# EAGLE design Atmega16 (EAGLE 6.2)
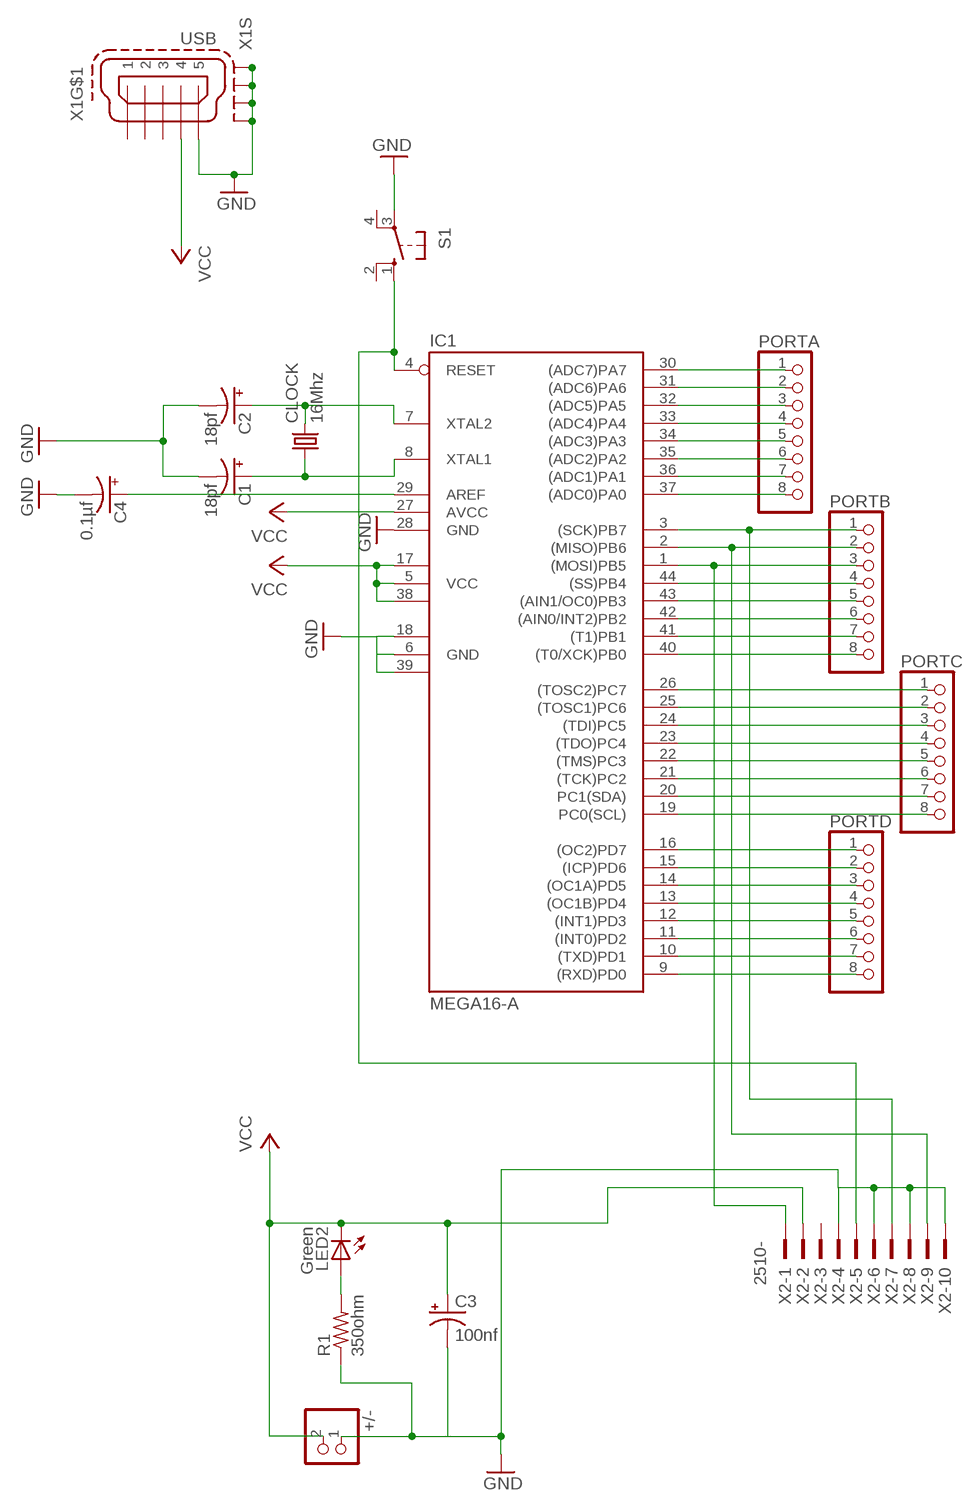
[diagram p0: schematic, sheet 1]

## Parts
+/-  PINHD-1X2  [1X02]
C1  18pf  CPOL-USSMCZ  [SMC_Z]
C2  18pf  CPOL-USSMCZ  [SMC_Z]
C3  100nf  CPOL-USSMCZ  [SMC_Z]
C4  0.1µf  CPOL-USSMCZ  [SMC_Z]
CLOCK  16Mhz  CRYSTALHC49UP  [HC49UP]
IC1  MEGA16-A  [TQFP44]
LED2  Green  LG_T679-E1F1-1  [PLCC2]
PORTA  PINHD-1X8  [1X08]
PORTB  PINHD-1X8  [1X08]
PORTC  PINHD-1X8  [1X08]
PORTD  PINHD-1X8  [1X08]
R1  350ohm  R-US_M0805  [M0805]
S1  10-XX  [B3F-10XX]
X1  USB  MINI-USB-SCHIELD-32005-201  [32005-201]
X2  2510-  [PAK100/2500-10]

## Nets
GND: +/-.1 C1.- C2.- C3.- C4.- IC1.6(GND) IC1.18(GND1) IC1.28(GND) IC1.39(GND2) R1.1 S1.3(P) X1.5 X1.M1(S:S1) X1.M2(S:S2) X1.M3(S:S3) X1.M4(S:S4) X2.4 X2.6 X2.8 X2.10
N$1: C2.+ CLOCK.2 IC1.7(XTAL2)
N$2: IC1.16((OC2)PD7) PORTD.1
N$3: S1.1(S) X2.5
N$4: LED2.A R1.2
N$5: IC1.15((ICP)PD6) PORTD.2
N$6: IC1.14((OC1A)PD5) PORTD.3
N$7: C1.+ CLOCK.1 IC1.8(XTAL1)
N$8: C4.+ IC1.29(AREF)
N$10: IC1.13((OC1B)PD4) PORTD.4
N$12: IC1.12((INT1)PD3) PORTD.5
N$13: IC1.11((INT0)PD2) PORTD.6
N$14: IC1.10((TXD)PD1) PORTD.7
N$15: IC1.9((RXD)PD0) PORTD.8
N$16: IC1.26((TOSC2)PC7) PORTC.1
N$17: IC1.25((TOSC1)PC6) PORTC.2
N$18: IC1.24((TDI)PC5) PORTC.3
N$19: IC1.23((TDO)PC4) PORTC.4
N$20: IC1.22((TMS)PC3) PORTC.5
N$21: IC1.21((TCK)PC2) PORTC.6
N$22: IC1.20(PC1(SDA)) PORTC.7
N$23: IC1.19(PC0(SCL)) PORTC.8
N$24: IC1.3((SCK)PB7) PORTB.1 X2.7
N$25: IC1.2((MISO)PB6) PORTB.2 X2.9
N$26: IC1.1((MOSI)PB5) PORTB.3 X2.1
N$27: IC1.44((SS)PB4) PORTB.4
N$28: IC1.43((AIN1/OC0)PB3) PORTB.5
N$29: IC1.42((AIN0/INT2)PB2) PORTB.6
N$30: IC1.41((T1)PB1) PORTB.7
N$31: IC1.40((T0/XCK)PB0) PORTB.8
N$32: IC1.30((ADC7)PA7) PORTA.1
N$33: IC1.31((ADC6)PA6) PORTA.2
N$34: IC1.32((ADC5)PA5) PORTA.3
N$35: IC1.33((ADC4)PA4) PORTA.4
N$36: IC1.34((ADC3)PA3) PORTA.5
N$37: IC1.35((ADC2)PA2) PORTA.6
N$38: IC1.36((ADC1)PA1) PORTA.7
N$39: IC1.37((ADC0)PA0) PORTA.8
VCC: +/-.2 C3.+ IC1.5(VCC) IC1.17(VCC1) IC1.27(AVCC) IC1.38(VCC2) LED2.C X1.4 X2.2
Unconnected: IC1.4(RESET) S1.2(S1) S1.4(P1) X1.1 X1.2 X1.3 X2.3

## Library data of the parts
+/- = pinhead:PINHD-1X2: PIN HEADER
C1-C4 = rcl:CPOL-US: POLARIZED CAPACITOR, American symbol
CLOCK = crystal:CRYSTAL: CRYSTAL; OC_FARNELL: unknown; OC_NEWARK: unknown
IC1 = atmel:MEGA16: MICROCONTROLLER 16 Kbytes FLASH 1 kbytes SRAM 512 bytes EEPROM USART 8-channel 10 bit ADC Source: avr.lbr; MPN: ATMEGA16-16AU; OC_FARNELL: 9171134; OC_NEWARK: 96K6515
LED2 = led:*_T679-?-1: LC TOPLED® Low Current LED Source: http://catalog.osram-os.com .. LG_LS_LY_T679_OBS.pdf; COLOR: green
PORTA PORTB PORTC PORTD = pinhead:PINHD-1X8: PIN HEADER
R1 = rcl:R-US_: RESISTOR, American symbol
S1 = switch-omron:10-XX: OMRON SWITCH; MPN: B3F-1000; OC_FARNELL: 176432; OC_NEWARK: 36M3542
X1 = con-cypressindustries:MINI-USB-SCHIELD-: MINI USB-B Conector Source: www.cypressindustries.com; OC_FARNELL: unknown; OC_NEWARK: unknown
X2 = con-3m:2510-: 3M (TM) Pak 100 4-Wall Header Source: 3M; MF: 3M; MPN: 2510-6002UB; OC_FARNELL: 9838244; OC_NEWARK: 46F4725

## Board
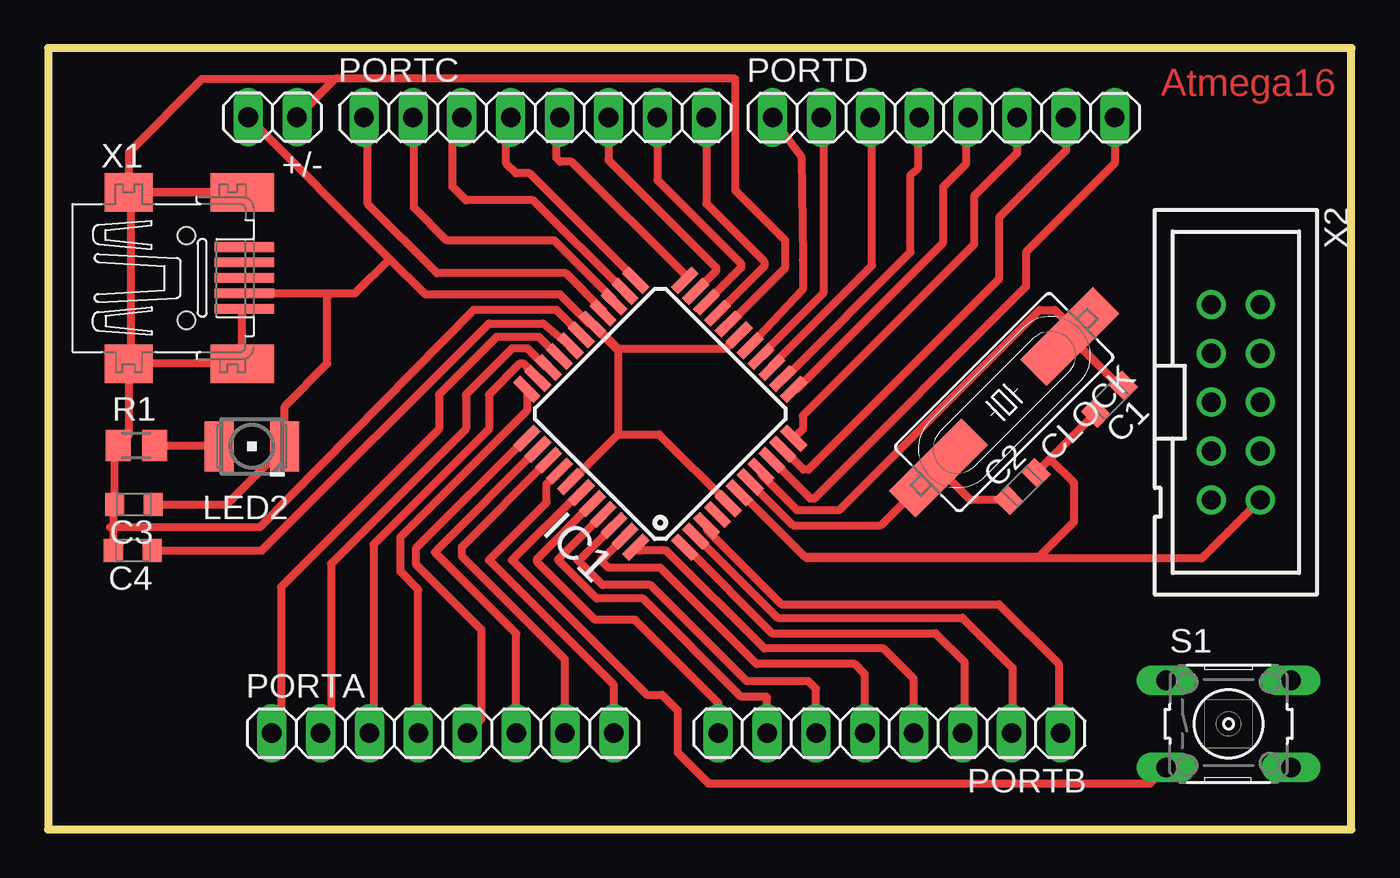
[diagram p1: board, top side]
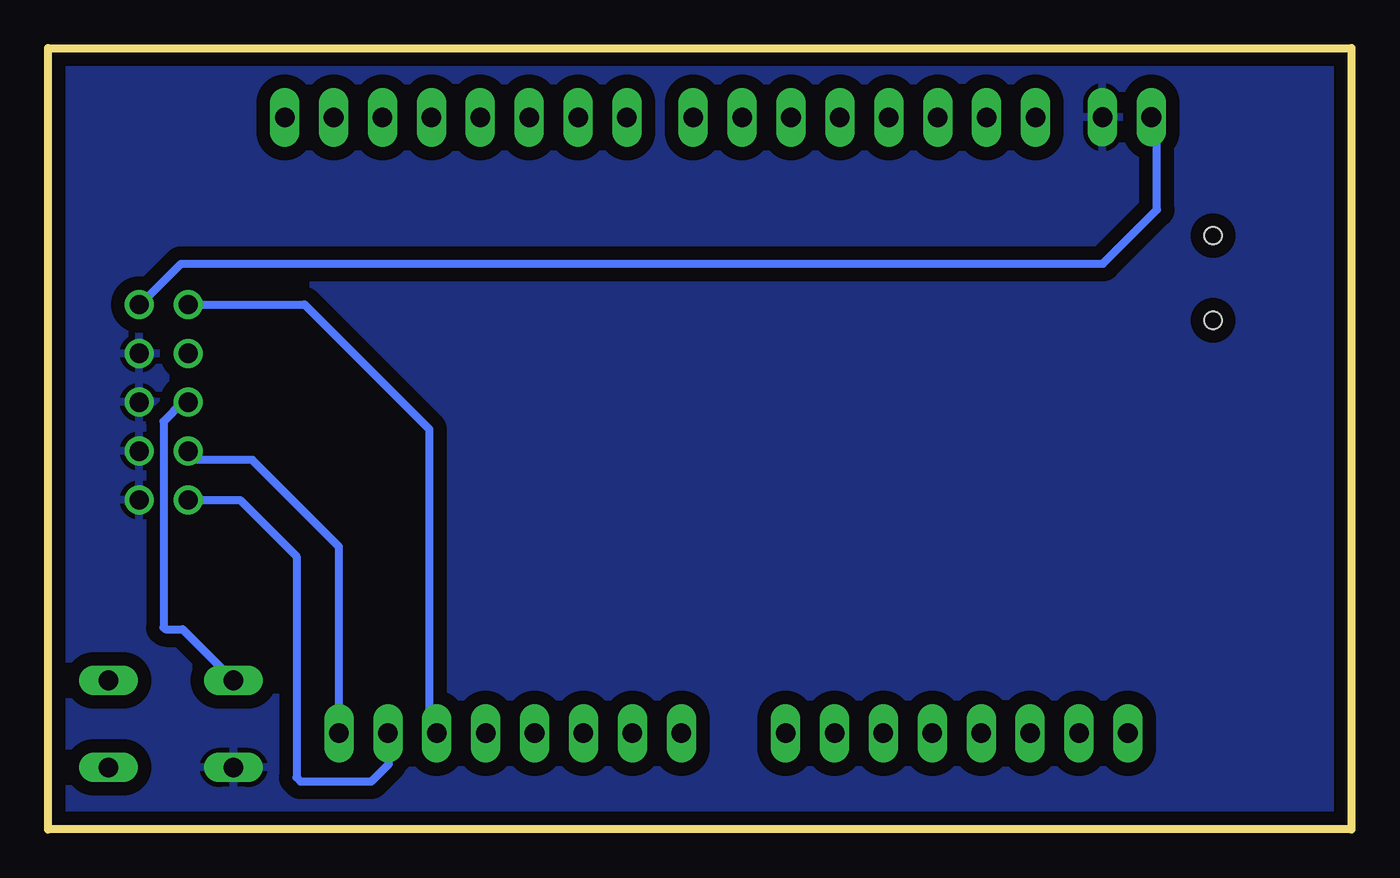
[diagram p2: board, bottom side, seen from below]

Size 67.7 x 40.6 mm. Coordinates in mm from the lower left corner, seen from the top.
Outline: 0,40.6 0,0 67.7,0 67.7,40.6 0,40.6
Copper layers (1*16): Top 0.035mm / dielectric 1.5mm / Bottom 0.035mm
Design rules: minimum track width 10mil, minimum drill 24mil, track to track 4mil, track to pad 4mil, pad to pad 8mil, via to via 8mil, smd to smd 8mil, copper to edge 10mil, drill to drill 8mil, minimum pad ring 10mil, minimum via ring 8mil, stop-mask expansion 4mil, vias tented up to drill 0mil, thermal gap 10mil

### Footprints (pad centres in the part's own frame; a part is rotated, then mirrored left to right if it is on the bottom)
1X02 = drill 1.016 long: 1 -1.27,0; 2 1.27,0
SMC_Z = smd 1 x 1.2: + -1,0; - 1,0
HC49UP = smd 5.334 x 1.93: 1 -4.826,0; 2 4.826,0
TQFP44 = smd 1.5 x 0.5: 1 -5.8,4; 2 -5.8,3.2; 3 -5.8,2.4; 4 -5.8,1.6; 5 -5.8,0.8; 6 -5.8,0; 7 -5.8,-0.8; 8 -5.8,-1.6; 9 -5.8,-2.4; 10 -5.8,-3.2; 11 -5.8,-4; 23 5.8,-4; 24 5.8,-3.2; 25 5.8,-2.4; 26 5.8,-1.6; 27 5.8,-0.8; 28 5.8,0; 29 5.8,0.8; 30 5.8,1.6; 31 5.8,2.4; 32 5.8,3.2; 33 5.8,4 | smd 0.5 x 1.5: 12 -4,-5.8; 13 -3.2,-5.8; 14 -2.4,-5.8; 15 -1.6,-5.8; 16 -0.8,-5.8; 17 0,-5.8; 18 0.8,-5.8; 19 1.6,-5.8; 20 2.4,-5.8; 21 3.2,-5.8; 22 4,-5.8; 34 4,5.8; 35 3.2,5.8; 36 2.4,5.8; 37 1.6,5.8; 38 0.8,5.8; 39 0,5.8; 40 -0.8,5.8; 41 -1.6,5.8; 42 -2.4,5.8; 43 -3.2,5.8; 44 -4,5.8
PLCC2 = smd 2.6 x 1.5: A 0,1.7; C 0,-1.7
1X08 = drill 1.016 long: 1 -8.89,0; 2 -6.35,0; 3 -3.81,0; 4 -1.27,0; 5 1.27,0; 6 3.81,0; 7 6.35,0; 8 8.89,0
M0805 = smd 1.3 x 1.6: 1 -0.95,0; 2 0.95,0
B3F-10XX = drill 1.016 long: 1 -3.251,2.261; 2 3.251,2.261; 3 -3.251,-2.261; 4 3.251,-2.261
32005-201 = smd 3.1 x 0.5: 1 3,1.6; 2 3,0.8; 3 3,0; 4 3,-0.8; 5 3,-1.6 | smd 2.5 x 2: M1 -3,-4.45; M2 -3,4.45 | smd 3.3 x 2: M3 2.9,4.45; M4 2.9,-4.45 | hole 0.9: 0,2.2; 0,-2.2
PAK100/2500-10 = drill 1 pad 1.422: 1 -5.08,-1.27; 2 -5.08,1.27; 3 -2.54,-1.27; 4 -2.54,1.27; 5 0,-1.27; 6 0,1.27; 7 2.54,-1.27; 8 2.54,1.27; 9 5.08,-1.27; 10 5.08,1.27

### Placement (x,y rotation side)
+/-  11.66,37.01 180 top
C1  55.13,22.35 225 top
C2  50.6,17.82 45 top
C3  4.46,16.89 180 top
C4  4.4,14.5 180 top
CLOCK  49.66,22.2 225 top
IC1  31.8,21.6 135 top
LED2  10.59,19.91 90 top
PORTA  20.5,5 0 top
PORTB  43.7,5 180 top
PORTC  25.3,37 0 top
PORTD  46.52,36.99 0 top
R1  4.58,19.95 0 top
S1  61.32,5.49 0 top
X1  7.19,28.66 0 top
X2  61.7,22.2 270 top

### Tracks (layer width: path | path; a pad name or v marks a point on that pad's centre or on a via)
GND
  Top 0.406: IC1.18 35.37,26.27 38.3,29.2 38.3,30.6 35.7,33.2 35.7,39 14.92,39 | 14.92,39 +/-.1 | 14.92,39 8,39 4.2,35.2 4.2,33.3 4.3,33.2 | C4.- 3.4,15.8 | 3.4,15.8 3.4,16.83 C3.- 3.46,19.78 R1.1 4.19,20.51 X1.M1 | X1.M1 X1.M4 10.09,26.96 X1.5 | X1.M2 X1.M3 4.39,33.11 4.3,33.2 | 4.3,33.2 4.3,24.32 X1.M1 | IC1.28 26.4,27 22.1,27 11,15.7 3.2,15.7 3.4,15.8 | IC1.39 27.6,17.5 24.1,14 31.1,7 31.9,7 32.7,6.2 32.7,4 34.3,2.4 57.24,2.4 S1.3 | C2.- 52.04,19.26 | 52.04,19.26 C1.- | 39.3,14.2 36,17.5 IC1.6 | 39.3,14.2 51.5,14.2 53.3,16 53.3,18 52.04,19.26 | 39.3,14.2 39.4,14.1 59.95,14.1 X2.10
  pour Bottom (isolate 0.7): 1.1,40.2 67.1,40.2 67.1,0.2 0.1,0.2 0.1,40.2
N$1
  Top 0.406: C2.+ 47.92,17.11 CLOCK.2 43.26,15.8 38.7,15.8 36.47,18.03 IC1.7
N$2
  Top 0.406: PORTD.1 39.13,34.97 39.2,29.6 39.2,28.07 IC1.16
N$3
  Bottom 0.406: X2.5 60.7,22.2 61.7,21.2 61.7,10.5 61.6,10.4 60.72,10.4 S1.1
N$4
  Top 0.406: R1.2 8.85,19.95 LED2.A
N$5
  Top 0.406: IC1.15 37.03,24.63 40.3,27.9 40.3,36.86 PORTD.2
N$6
  Top 0.406: IC1.14 37.6,24.1 42.8,29.3 42.8,36.9 PORTD.3
N$7
  Top 0.406: C1.+ 55.63,23.06 CLOCK.1 53.26,25.8 53.5,25.8 52.3,27 51.5,27 41.1,16.6 38.9,16.6 37.03,18.47 IC1.8
N$8
  Top 0.406: IC1.29 27.06,25.14 25.7,26.3 22.9,26.3 11.1,14.5 C4.+
N$10
  Top 0.406: IC1.13 38.24,23.44 44.8,30 44.8,34 45.2,34.4 45.2,36.94 PORTD.4
N$12
  Top 0.406: IC1.12 38.87,22.87 46.5,30.5 46.5,33.4 47.7,34.6 47.7,36.9 PORTD.5
N$13
  Top 0.406: PORTD.6 50.33,35.13 48.1,32.9 48.1,30.4 39.2,21.5 39.2,20.8 IC1.11
N$14
  Top 0.406: PORTD.7 52.87,35.27 49.4,31.8 49.4,28.6 39.5,18.7 39.23,18.7 IC1.10
N$15
  Top 0.406: PORTD.8 55.41,34.61 50.8,30 50.8,28.2 39.8,17.2 39.59,17.2 IC1.9
N$16
  Top 0.406: IC1.26 28.83,26.97 26.9,28.9 20.2,28.9 16.6,32.5 16.6,36.81 PORTC.1
N$17
  Top 0.406: IC1.25 29.4,27.5 26.3,30.6 20.7,30.6 19,32.3 19,36.95 PORTC.2
N$18
  Top 0.406: IC1.24 29.94,27.96 25.2,32.7 21.7,32.7 21,33.4 21,36.51 PORTC.3
N$19
  Top 0.406: IC1.23 30.53,28.57 25,34.1 24.3,34.1 23.8,34.6 23.8,36.77 PORTC.4
N$20
  Top 0.406: IC1.22 33.07,28.83 27.2,34.7 26.6,34.7 26.4,34.9 26.4,36.83 PORTC.5
N$21
  Top 0.406: PORTC.6 29.11,34.79 34.7,29.2 34.7,29.02 IC1.21
N$22
  Top 0.406: PORTC.7 31.65,33.75 36,29.4 36,29.19 IC1.20
N$23
  Top 0.406: PORTC.8 34.19,32.51 37.2,29.5 37.2,29.26 IC1.19
N$24
  Top 0.406: IC1.3 34.2,15.6 38.1,11.7 49.4,11.7 52.5,8.6 52.5,5.09 PORTB.1
  Bottom 0.406: PORTB.1 52.59,14.69 57.1,19.2 59.97,19.2 X2.7
N$25
  Top 0.406: IC1.2 33.66,15.24 37.9,11 47.5,11 50.1,8.4 50.1,5.05 PORTB.2
  Bottom 0.406: X2.9 57.72,17.12 54.8,14.2 54.8,2.7 54.6,2.5 50.9,2.5 50,3.4 50,4.95 PORTB.2
N$26
  Top 0.406: IC1.1 33.13,14.67 37.6,10.2 46.1,10.2 47.6,8.7 47.6,5.09 PORTB.3
  Bottom 0.406: X2.1 54.38,27.28 47.9,20.8 47.9,5.39 PORTB.3
N$27
  Top 0.406: PORTB.4 44.97,7.83 43.4,9.4 37.2,9.4 32.1,14.5 30.7,14.5 IC1.44
N$28
  Top 0.406: PORTB.5 42.43,8.07 41.9,8.6 36.8,8.6 31.8,13.6 29.1,13.6 28.7,14 28.93,14.2 IC1.43
N$29
  Top 0.406: PORTB.6 39.89,7.31 39.5,7.7 36.3,7.7 31.3,12.7 28.8,12.7 27.5,14 27.59,14 IC1.42
N$30
  Top 0.406: PORTB.7 37.35,6.85 37.3,6.9 36,6.9 30.9,12 28.5,12 26.5,14 26.5,14.04 IC1.41
N$31
  Top 0.406: PORTB.8 34.81,6.59 30.5,10.9 28.4,10.9 25.4,13.9 25.4,14.07 IC1.40
N$32
  Top 0.406: IC1.30 26.53,24.57 25.5,25.6 23.3,25.6 20.3,22.6 20.3,20.8 12.1,12.6 12.1,5.49 PORTA.1
N$33
  Top 0.406: IC1.31 25.9,24 24.9,25 24.1,25 21.7,22.6 21.7,20.8 14.7,13.8 14.7,5.55 PORTA.2
N$34
  Top 0.406: IC1.32 25.44,23.46 24.7,24.2 24.5,24.2 22.9,22.6 22.9,20.8 16.9,14.8 16.9,5.21 PORTA.3
N$35
  Top 0.406: PORTA.4 19.23,12.47 18.3,13.4 18.3,15.2 24.9,21.8 24.9,22.84 IC1.33
N$36
  Top 0.406: IC1.34 24.83,20.33 19.1,14.6 19.1,13.8 22.5,10.4 22.5,5.73 PORTA.5
N$37
  Top 0.406: PORTA.6 24.31,10.19 20.1,14.4 20.28,14.6 IC1.35
N$38
  Top 0.406: PORTA.7 26.85,8.85 21.5,14.2 21.5,14.69 IC1.36
N$39
  Top 0.406: PORTA.8 29.39,7.51 22.9,14 25.9,17 25.9,17.96 IC1.37
VCC
  Top 0.406: IC1.27 28.13,26.27 26.6,27.8 19.6,27.8 17.75,29.65 | 17.75,29.65 +/-.2 | IC1.27 28.26,26.24 29.5,25 29.6,25 | 29.6,25 35.2,25 IC1.17 | IC1.27 28.33,26.27 29.6,25 | 29.6,25 29.6,20.53 | 29.6,20.53 IC1.38 | 35.34,16.96 IC1.5 31.74,20.53 29.6,20.53 | C3.+ 9.27,16.89 LED2.C 12.29,21.99 14.5,24.2 14.5,27.66 14.7,27.86 | X1.4 14.7,27.86 | 14.7,27.86 15.96,27.86 17.75,29.65
  Bottom 0.406: X2.2 62.92,27.28 60.8,29.4 12.9,29.4 10.1,32.2 10.1,36.72 +/-.2

### Text on the board
Top: Atmega16